# Altium schematic sheet DRIVER_3.SchDoc
size A3; SheetNumber: 13; SheetTotal: 14
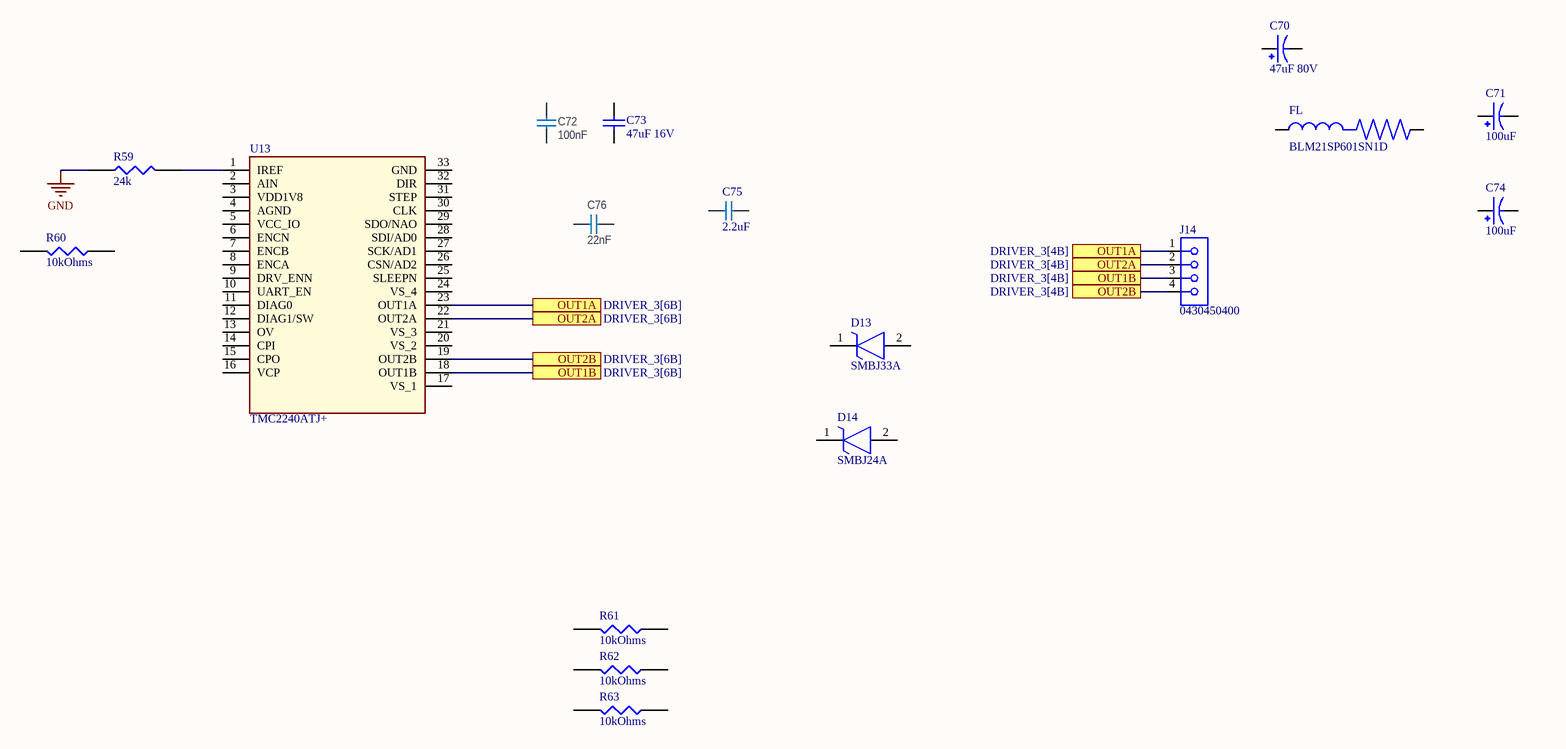
[diagram p0: DRIVER_3.SchDoc]

## Parts
C70  47uF 80V  [CAP_EEEFK1K470P]
C71  100uF  [CAP_EEEFK1J101P]
C72  100nF  [CAPC0603X03L_C]
C73  value 47uF 16V  [CAP1210]  (hidden comment: CAP CER 47UF 16V X5R 1210)
C74  100uF  [CAP_EEEFK1J101P]
C75  2.2uF  [CAPC1608X100N]
C76  22nF  [CAPC0603X03L_C]
D13  SMBJ33A  [SMBJ12A]
D14  SMBJ24A  [SMBJ12A]
FL  BLM21SP601SN1D  [BEADC2012X105N]
J14  0430450400  [CONN_SD-43045-001_04_MOL]
R59  24k  [0603]
R60  10kOhms  [RESC0603X03L_C]
R61  10kOhms  [RESC0603X03L_C]
R62  10kOhms  [RESC0603X03L_C]
R63  10kOhms  [RESC0603X03L_C]
U13  TMC2240ATJ+  [QFN50P500X500X80-33N]

## Ports
OUT1A (see DRIVER_3[4B]), OUT1A (see DRIVER_3[6B]), OUT1B (see DRIVER_3[4B]), OUT1B (see DRIVER_3[6B]), OUT2A (see DRIVER_3[4B]), OUT2A (see DRIVER_3[6B]), OUT2B (see DRIVER_3[4B]), OUT2B (see DRIVER_3[6B])

## Nets
GND: R59.1
OUT1A: J14.1 U13.23(OUT1A) ; port OUT1A
OUT1B: J14.3 U13.18(OUT1B) ; port OUT1B
OUT2A: J14.2 U13.22(OUT2A) ; port OUT2A
OUT2B: J14.4 U13.19(OUT2B) ; port OUT2B
NetR59_2: R59.2 U13.1(IREF)

Not connected (* = marked no-connect by the designer): C70 1 2; C71 1 2; C72 1 2; C73 1 2; C74 1 2; C75 1 2; C76 1 2; D13 1(K) 2(A); D14 1(K) 2(A); FL 1 2; R60 1 2; R61 1 2; R62 1 2; R63 1 2; U13 2(AIN) 3(VDD1V8) 4(AGND) 5(VCC_IO) 6(ENCN) 7(ENCB) 8(ENCA) 9(DRV_ENN) 10(UART_EN) 11(DIAG0) 12(DIAG1/SW) 13(OV) 14(CPI) 15(CPO) 16(VCP) 17(VS_1) 20(VS_2) 21(VS_3) 24(VS_4) 25(SLEEPN) 26(CSN/AD2) 27(SCK/AD1) 28(SDI/AD0) 29(SDO/NAO) 30(CLK) 31(STEP) 32(DIR) 33(GND)

## Library data of the parts
C70 = EEE-FK1K470P: 47 µF 80 V Aluminum Electrolytic Capacitors Radial, Can - SMD 2000 Hrs @ 105°C; Manufacturer: Panasonic Industry; Supplier: Digi; PCE3831DKR-ND
C71 C74 = EEE-FK1J101P: 100 µF 63 V Aluminum Electrolytic Capacitors Radial, Can - SMD 2000 Hrs @ 105°C; Manufacturer: Panasonic Industry; Supplier: Digi; PCE3819DKR-ND
C72 = C0201-100n-25V-X5R: Capacitor, Ceramic, X5R, ±10%, 25V; Manufacturer: Murata; Manufacturer Part Number: GRM033R61E104KE14J; Part number NEMS: 100200459; Artikkelnr Noca: N.A.; Pad Count: 2; Component Status: Active; Part Number: C0201-100n-25V-X5R; LatestRevisionDate: 2020-12-16; Published: 2020-12-16; Value: 100nF; Note: 25V; Footprint Doc: 0201; Part number IPS: N.A.; ComponentLink1URL: https://search.murata.co.jp/Ceramy/image/img/A01X/G101/ENG/GRM033R61E104KE14-01.pdf; ComponentLink1Description: Datasheet; ComponentLink2URL: https://www.murata.com/en-global/products/productdetail?partno=GRM033R61E104KE14%23; ComponentLink2Description: Supplier link; HelpURL: N.A.; Supplier 1: Digi-Key; Supplier Part Number 1: 490-14571-1-ND; Supplier 2: Mouser; Supplier Part Number 2: 81-GRM033R61E104KE4J; Component Class: Capacitors; PartId: 100200459; Author: rsk; Part number Norautron: N.A.
C73 = CAP1210_47UF_16V: 16V 47uF X5R ±10% 1210 Multilayer Ceramic Capacitors MLCC - SMD/SMT ROHS; Manufacturer Part Number: CS3225X5R476K160NRL; Order Code: LCSC: C2918513; LCSC Manufacturer Part Number: CS3225X5R476K160NRL; LCSC Part Number: C2918513
C75 = 0603X225K250CT: 2.2 µF ±10% 25V Ceramic Capacitor X5R 0603 (1608 Metric); Manufacturer: Walsin Technology Corporation; Supplier: Digi; 1292-0603X225K250CTDKR-ND; JLCPCB PART#: C237194
C76 = C0201-22n-10V-X5R-GRM033R61A223KE84_1: Capacitor, Ceramic, 22nF 10V X5R 0201,±10%; Manufacturer: Murata; Manufacturer Part Number: GRM033R61A223KE84D; Part number NEMS: 100200495; Pad Count: 2; Artikkelnr Noca: N.A.; Component Status: Active; Part Number: C0201-22n-10V-X5R-GRM033R61A223KE84; Component Class: Capacitors; Author: prbu; ComponentLink1URL: https://www.murata.com/en-sg/products/productdetail?partno=GRM033R61A223KE84%23; ComponentLink1Description: Datasheet; ComponentLink2URL: https://www.mouser.com/ProductDetail/Murata-Electronics/GRM033R61A223KE84E?qs=BZBei1rCqCCPqziwOnRusw%3D%3D; ComponentLink2Description: Supplier link; HelpURL: N.A.; Footprint Doc: 0201; LatestRevisionDate: 2021-12-09; Published: 2021-12-09; Value: 22nF; Note: 10V; Supplier 1: Mouser; Supplier Part Number 1: 81-GRM033R61A223KE4E; Supplier 2: Digi-Key; Supplier Part Number 2: 490-13334-1-ND; Part number IPS: N.A.; Part number Norautron: N.A.; PartId: 100200495
D13 = SMBJ33A: TVS Diode (Uni-directional); Manufacturer_Name: STMicroelectronics; Datasheet Link: https://www.st.com/resource/en/datasheet/smbj12a.pdf; Height: 2.45mm; Manufacturer_Part_Number: SMBJ33A
D14 = SMBJ24A: TVS Diode (Uni-directional); Manufacturer_Name: STMicroelectronics; Datasheet Link: https://www.st.com/resource/en/datasheet/smbj12a.pdf; Height: 2.45mm; Manufacturer_Part_Number: SMBJ24A
FL = BLM21SP601SN1D: 600 Ohms @ 100MHz 1 Power Line Ferrite Bead 0805 _2012 Metric_ 2.3A; MF: Murata Electronics North America; MP: BLM21SP601SN1D; Availability: Unavailable; SnapEDA_Link: https://www.snapeda.com/parts/BLM21SP601SN1D/Murata/view-part/3660838/?ref=snap; Package: 2012 Murata; Value: *; Price: None
J14 = 0430450400: Connector Header Through Hole, Right Angle 4 position 0.118" (3.00mm); Manifacturer: MOLEX; Supplier: Digi; WM1814-ND
R59 = RMCF0603FT24K0: 24 kOhms ±1% 0.1W, 1/10W Chip Resistor 0603 (1608 Metric) Automotive AEC-Q200 Thick Film; Manufacturer: Stackpole Electronics Inc; Supplier: Digi; RMCF0603FT24K0DKR-ND
R60-R63 = TNPW060310K0FHTA: 10 kOhms ±1% 0.1W, 1/10W Chip Resistor 0603 (1608 Metric) Automotive AEC-Q200 Thin Film; Manufacturer: Vishay Dale; Supplier: Digi; 541-3906-6-ND
U13 = TMC2240ATJ+: Bipolar Motor Driver Power MOSFET SPI, Step/Direction, UART 32-TQFN (5x5); Manufacturer: Analog Devices Inc./Maxim Integrated; Supplier: Digi; 505-TMC2240ATJ+-ND